# EAGLE schematic ampli-blt-cargador (EAGLE 9.6.2)

## Sheet 1 of 2
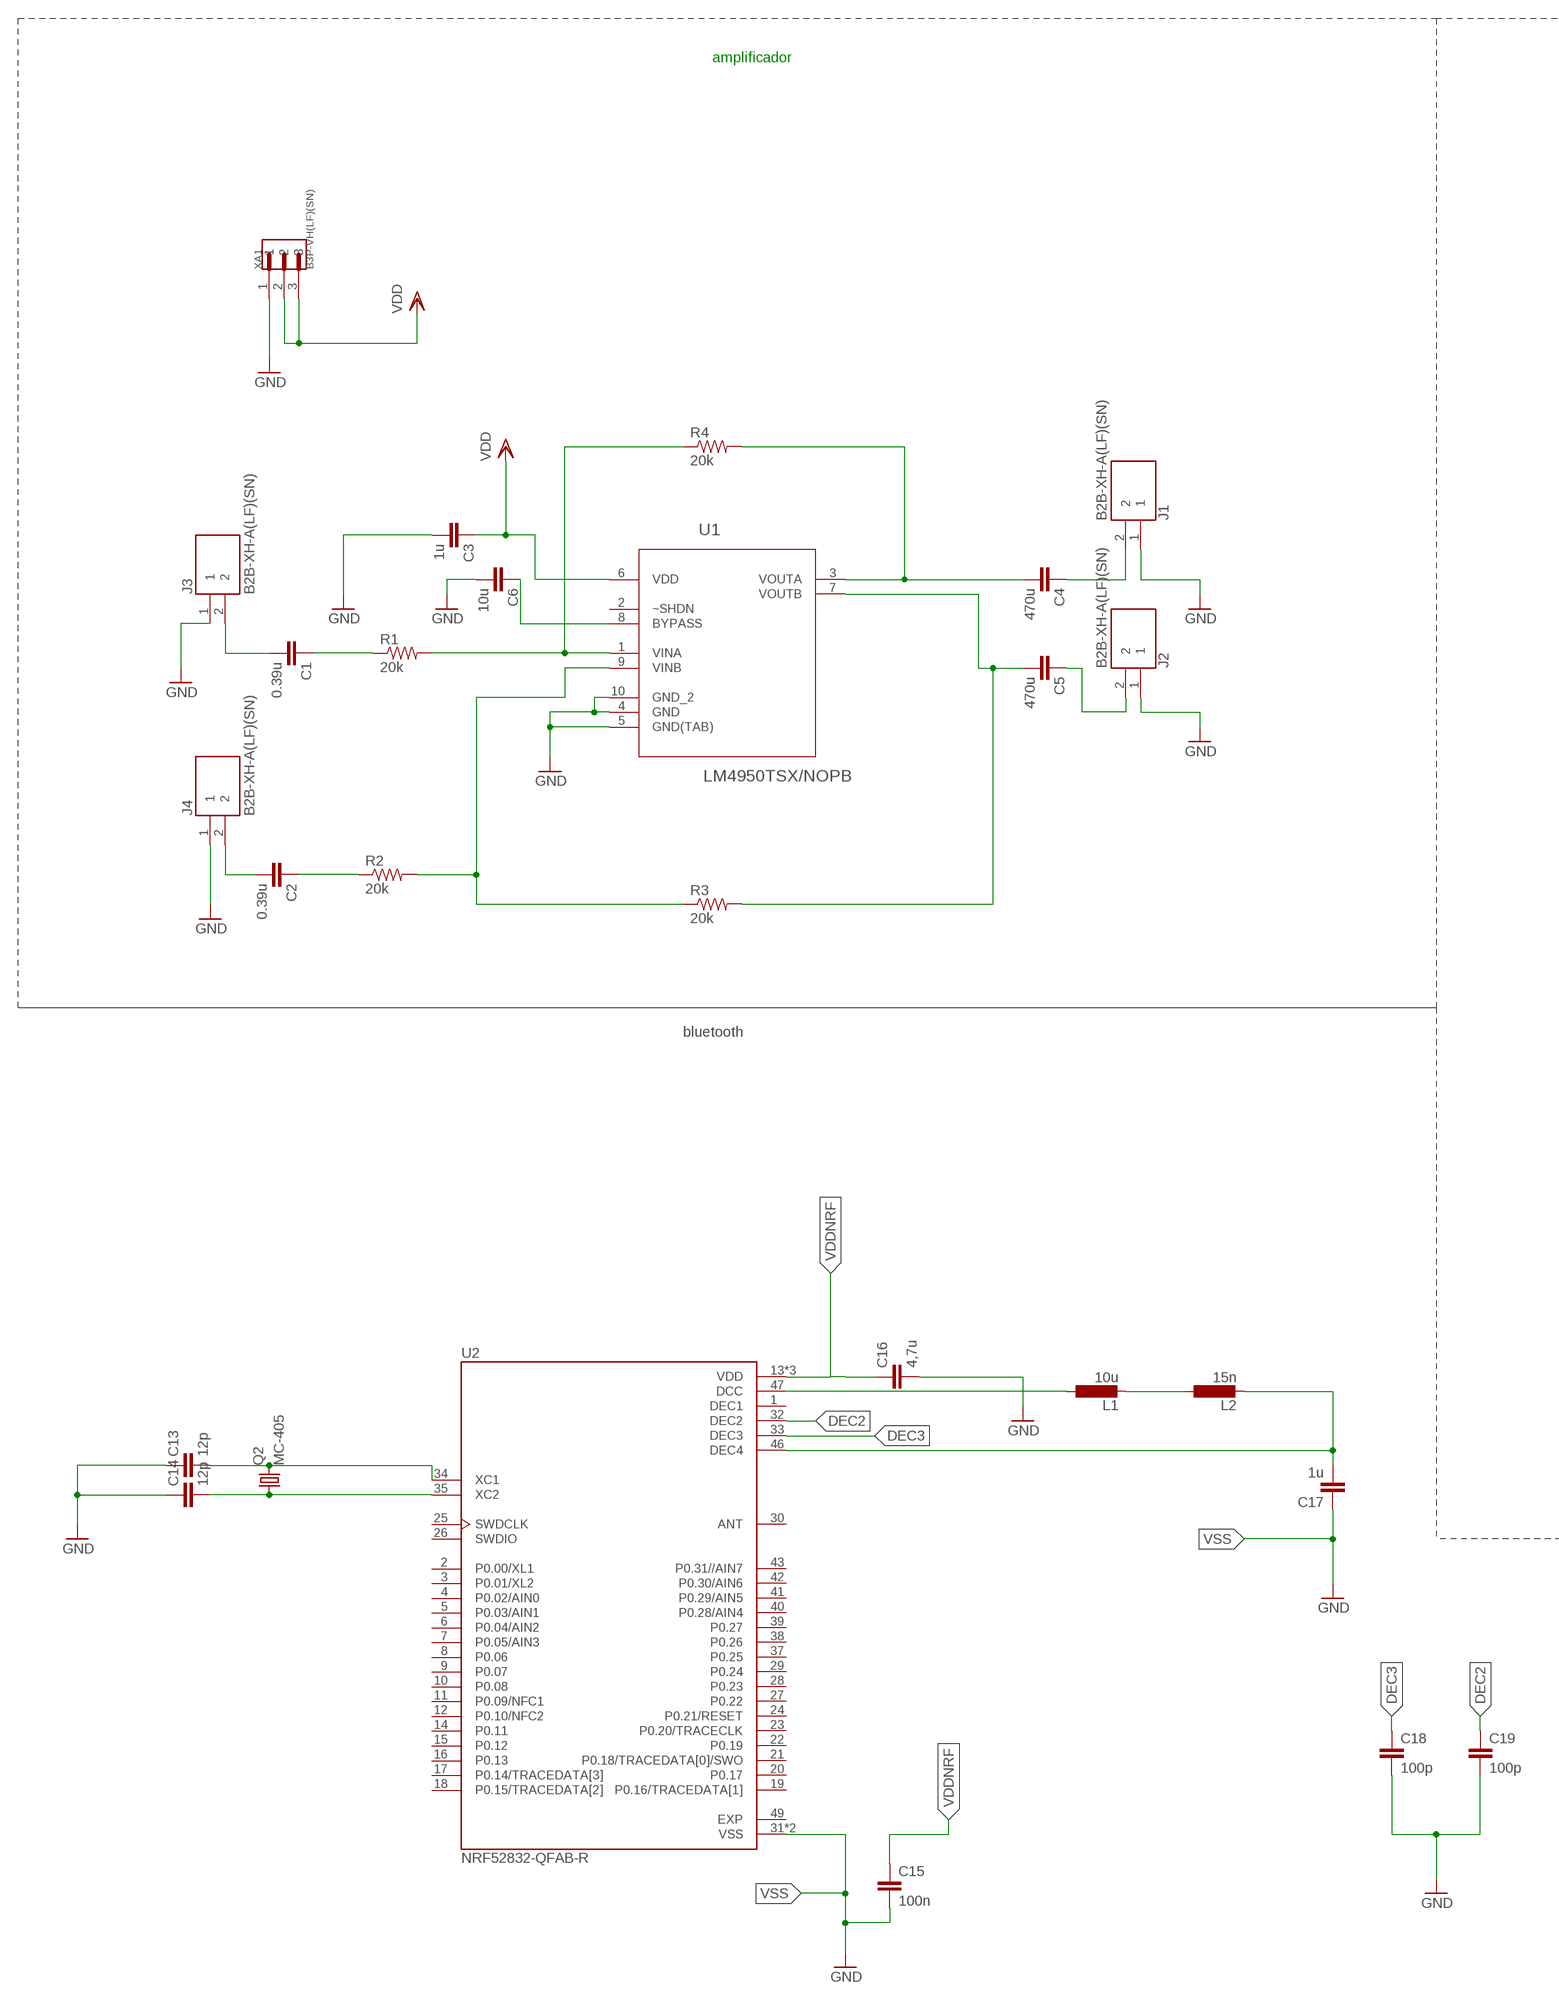
[diagram p0: schematic, sheet 1, part 1 of 2]
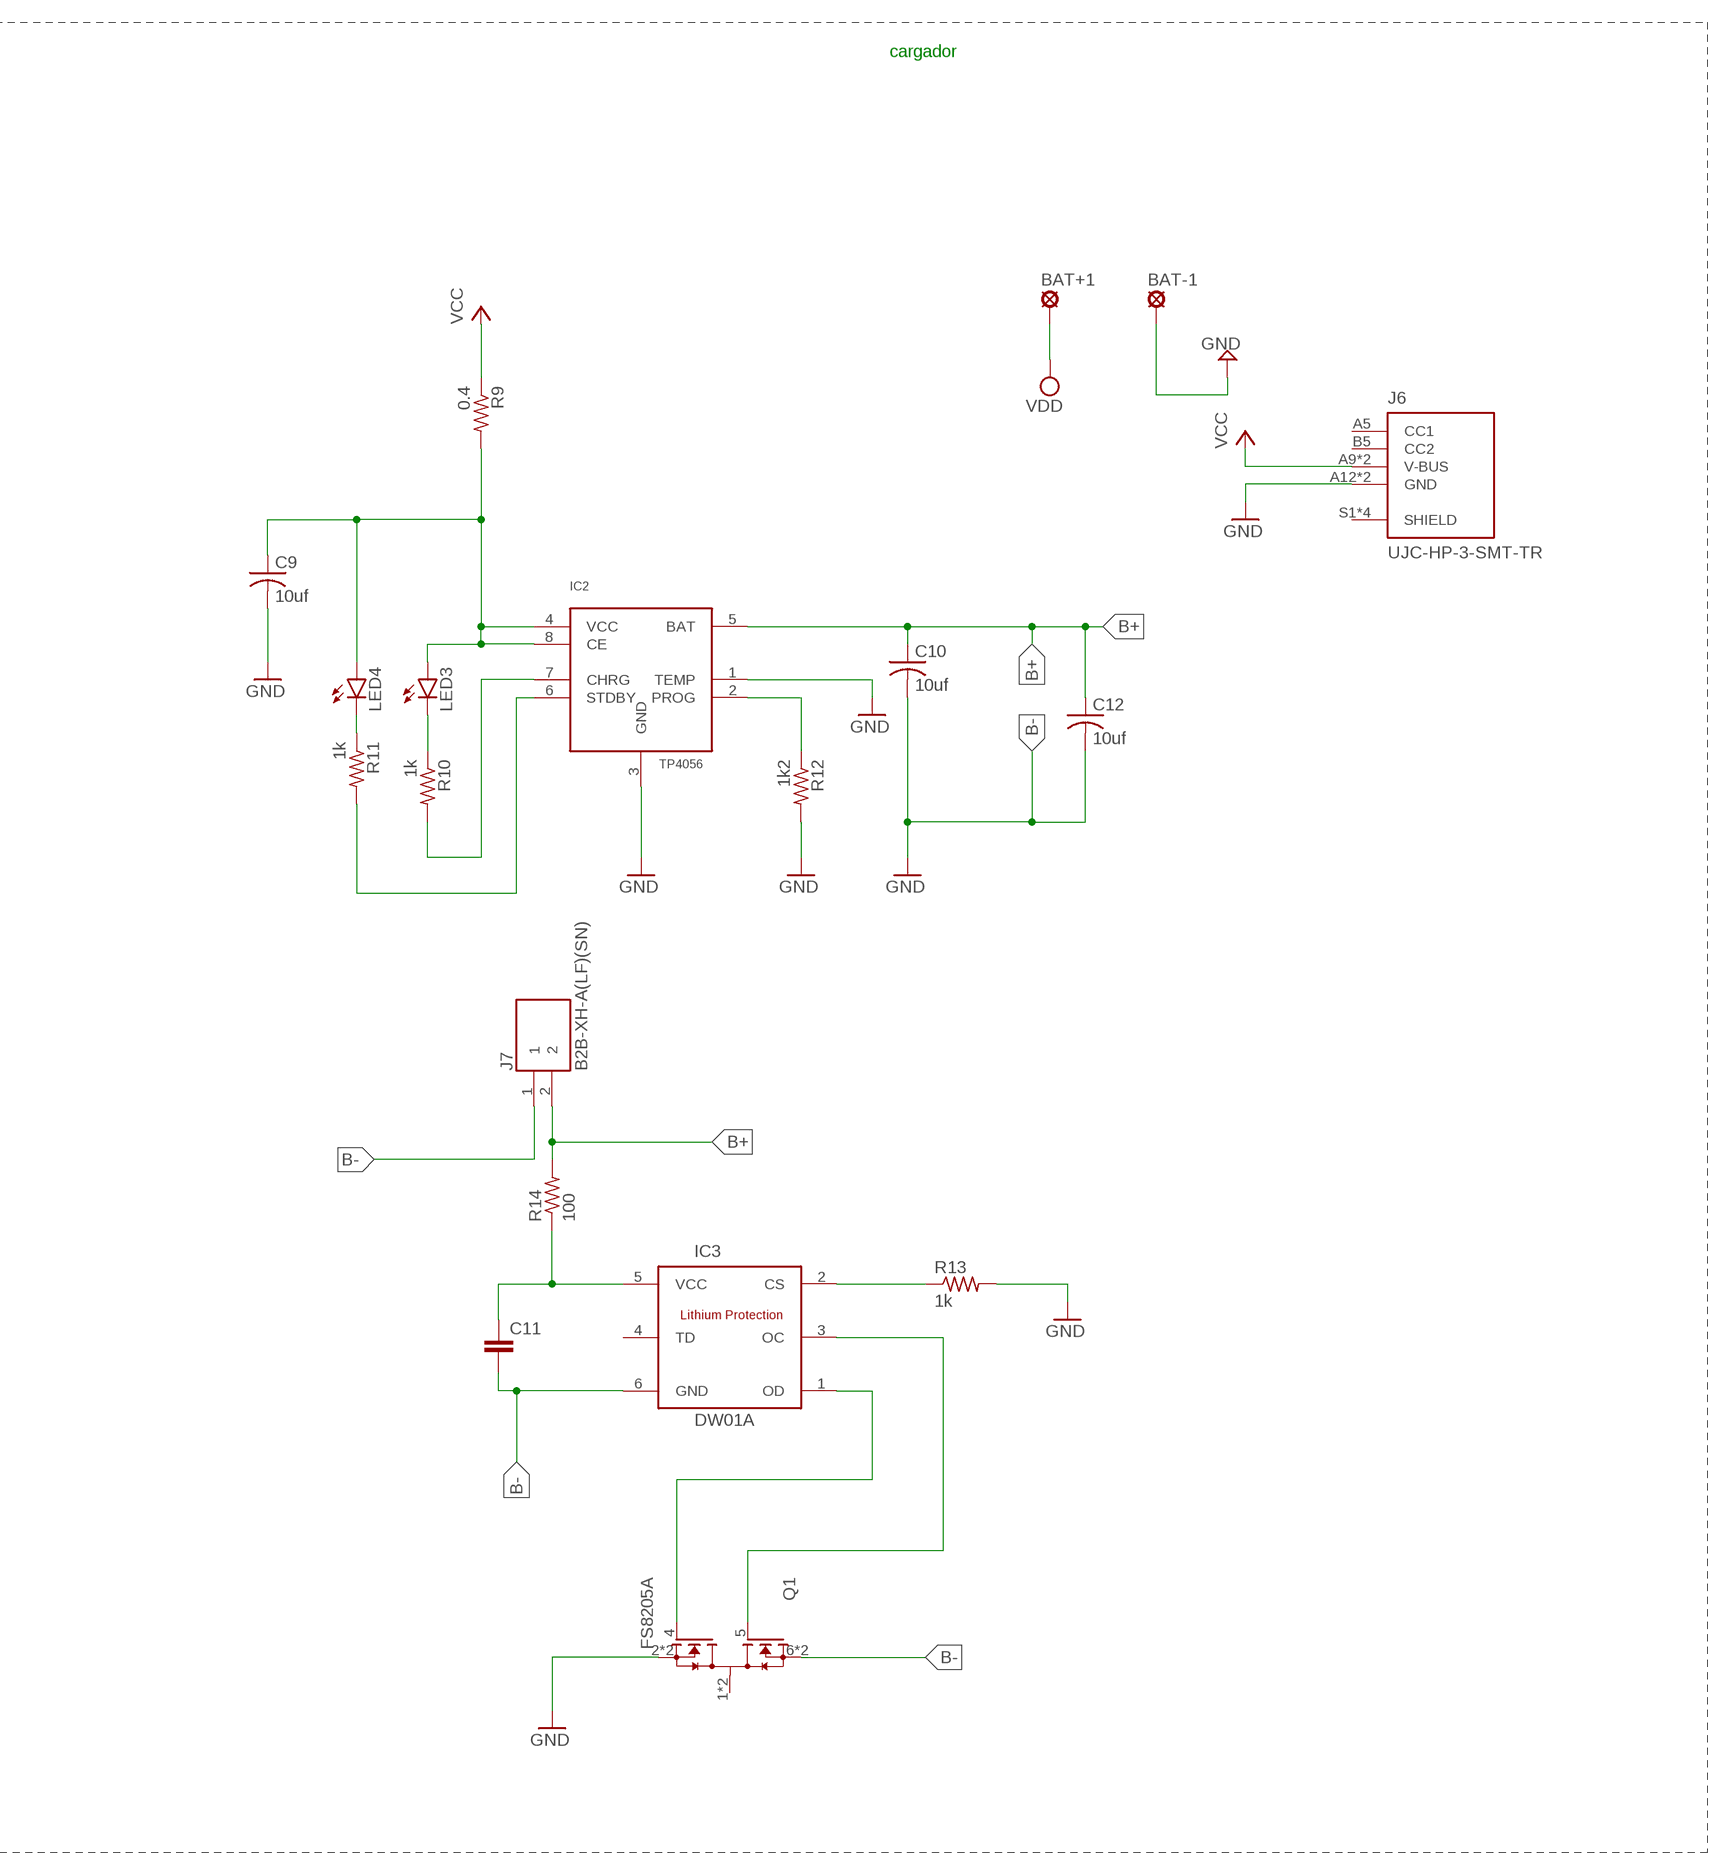
[diagram p1: schematic, sheet 1, part 2 of 2]

### Parts
BAT+1  LSP10  [LSP10]
BAT-1  LSP10  [LSP10]
C1  0.39u  C-EUC1206  [C1206]
C2  0.39u  C-EUC1206  [C1206]
C3  1u  C-EUC1206  [C1206]
C4  470u  C-EUC1206  [C1206]
C5  470u  C-EUC1206  [C1206]
C6  10u  C-EUC1206  [C1206]
C9  10uf  C-USC1206  [C1206]
C10  10uf  C-USC1206  [C1206]
C11  C-EUC1206  [C1206]
C12  10uf  C-USC1206  [C1206]
C13  12p  C-EUC1206  [C1206]
C14  12p  C-EUC1206  [C1206]
C15  100n  C-EUC1206  [C1206]
C16  4,7u  C-EUC1206  [C1206]
C17  1u  C-EUC1206  [C1206]
C18  100p  C-EUC1206  [C1206]
C19  100p  C-EUC1206  [C1206]
IC2  TP4056  [SOP-8]
IC3  DW01A  [SOT23-6]
J1  B2B-XH-A(LF)(SN)  [JST_B2B-XH-A(LF)(SN)]
J2  B2B-XH-A(LF)(SN)  [JST_B2B-XH-A(LF)(SN)]
J3  B2B-XH-A(LF)(SN)  [JST_B2B-XH-A(LF)(SN)]
J4  B2B-XH-A(LF)(SN)  [JST_B2B-XH-A(LF)(SN)]
J6  UJC-HP-3-SMT-TR  [CUI_UJC-HP-3-SMT-TR]
J7  B2B-XH-A(LF)(SN)  [JST_B2B-XH-A(LF)(SN)]
L1  10u  L-EUL2012C  [L2012C]
L2  15n  L-EUL2012C  [L2012C]
LED3  LEDSML1206  [SML1206]
LED4  LEDSML1206  [SML1206]
Q1  FS8205A  [SOP65P640X120-8N]
Q2  MC-405  [MC-405]
R1  20k  R-US_R1206  [R1206]
R2  20k  R-US_R1206  [R1206]
R3  20k  R-US_R1206  [R1206]
R4  20k  R-US_R1206  [R1206]
R9  0.4  R-US_R1206  [R1206]
R10  1k  R-US_R1206  [R1206]
R11  1k  R-US_R1206  [R1206]
R12  1k2  R-US_R1206  [R1206]
R13  1k  R-US_R1206  [R1206]
R14  100  R-US_R1206  [R1206]
U1  LM4950TSX/NOPB  [TO97P1435X457-10N]
U2  NRF52832-QFAB-R  [QFN40P600X600X90-49N]
XA1  B3P-VH(LF)(SN)  [JST_B3P-VH(LF)(SN)]

### Nets
B+: C10.1 C12.1 IC2.5(BAT) J7.2 R14.2
B-: C10.2 C11.2 C12.2 IC3.6(GND) J7.1 Q1.6(S2) Q1.7(S2) ; supply symbol labelled GND
DEC2: C19.1 U2.32(DEC2)
DEC3: C18.1 U2.33(DEC3)
GND: BAT-1.MP C3.2 C6.2 C9.2 C13.1 C14.1 C16.2 C18.2 C19.2 IC2.1(TEMP) IC2.3(GND) J1.1 J2.1 J3.1 J4.1 J6.A12(GND) J6.B12(GND) Q1.2(S1) Q1.3(S1) R12.2 R13.2 U1.4(GND) U1.5(GND(TAB)) U1.10(GND_2) XA1.1 ; also sheet 2
N$1: R2.2 R3.1 U1.9(VINB)
N$2: C2.1 R2.1
N$3: R1.2 R4.1 U1.1(VINA)
N$4: C1.1 R1.1
N$5: C6.1 U1.8(BYPASS)
N$6: C4.1 J1.2
N$7: C4.2 R4.2 U1.3(VOUTA)
N$8: C5.2 R3.2 U1.7(VOUTB)
N$9: C1.2 J3.2
N$10: C5.1 J2.2
N$11: C2.2 J4.2
N$12: IC3.2(CS) R13.1
N$19: C9.1 IC2.4(VCC) IC2.8(CE) LED3.A LED4.A R9.2
N$20: LED3.C R10.1
N$21: IC2.7(CHRG) R10.2
N$22: LED4.C R11.1
N$23: IC2.6(STDBY) R11.2
N$24: IC2.2(PROG) R12.1
N$25: IC3.3(OC) Q1.5(G2)
N$26: IC3.1(OD) Q1.4(G1)
N$27: C11.1 IC3.5(VCC) R14.1
N$28: C13.2 Q2.2 U2.34(XC1)
N$29: C14.2 Q2.1 U2.35(XC2)
N$30: L1.2 L2.1
N$31: L1.1 U2.47(DCC)
N$32: C17.2 L2.2 U2.46(DEC4)
VCC: J6.A9(V-BUS) J6.B9(V-BUS) R9.1 ; also sheet 2
VDD: BAT+1.MP C3.1 U1.6(VDD) XA1.2 XA1.3 ; also sheet 2
VDDNRF: C15.1 C16.1 U2.13(VDD) U2.36(VDD) U2.48(VDD)
VSS: C15.2 C17.1 U2.31(VSS) U2.45(VSS) ; supply symbol labelled GND
Unconnected: IC3.4(TD) J6.A5(CC1) J6.B5(CC2) J6.S1(SHIELD) J6.S2(SHIELD) J6.S3(SHIELD) J6.S4(SHIELD) Q1.1(D12) Q1.8(D12) U1.2(~SHDN) U2.2(P0.00/XL1) U2.3(P0.01/XL2) U2.4(P0.02/AIN0) U2.5(P0.03/AIN1) U2.6(P0.04/AIN2) U2.7(P0.05/AIN3) U2.8(P0.06) U2.9(P0.07) U2.10(P0.08) U2.11(P0.09/NFC1) U2.12(P0.10/NFC2) U2.14(P0.11) U2.15(P0.12) U2.16(P0.13) U2.17(P0.14/TRACEDATA[3]) U2.18(P0.15/TRACEDATA[2]) U2.19(P0.16/TRACEDATA[1]) U2.20(P0.17) U2.21(P0.18/TRACEDATA[0]/SWO) U2.22(P0.19) U2.23(P0.20/TRACECLK) U2.24(P0.21/RESET) U2.25(SWDCLK) U2.26(SWDIO) U2.27(P0.22) U2.28(P0.23) U2.29(P0.24) U2.30(ANT) U2.37(P0.25) U2.38(P0.26) U2.39(P0.27) U2.40(P0.28/AIN4) U2.41(P0.29/AIN5) U2.42(P0.30/AIN6) U2.43(P0.31//AIN7)

### Notes on the sheet
- cargador
- amplificador
- bluetooth

## Sheet 2 of 2
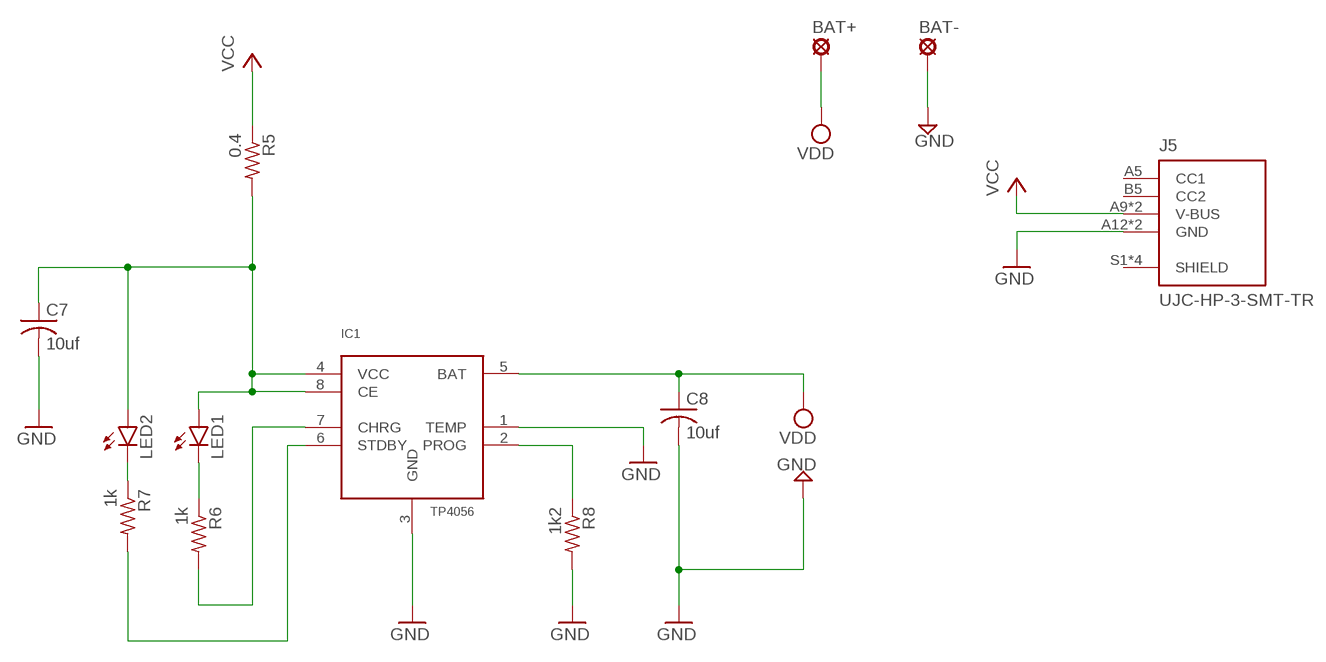
[diagram p2: schematic, sheet 2]

### Parts
BAT+  LSP10  [LSP10]
BAT-  LSP10  [LSP10]
C7  10uf  C-USC1206  [C1206]
C8  10uf  C-USC1206  [C1206]
IC1  TP4056  [SOP-8]
J5  UJC-HP-3-SMT-TR  [CUI_UJC-HP-3-SMT-TR]
LED1  LEDSML1206  [SML1206]
LED2  LEDSML1206  [SML1206]
R5  0.4  R-US_R1206  [R1206]
R6  1k  R-US_R1206  [R1206]
R7  1k  R-US_R1206  [R1206]
R8  1k2  R-US_R1206  [R1206]

### Nets
GND: BAT-.MP C7.2 C8.2 IC1.1(TEMP) IC1.3(GND) J5.A12(GND) J5.B12(GND) R8.2 ; also sheet 1
N$13: C7.1 IC1.4(VCC) IC1.8(CE) LED1.A LED2.A R5.2
N$14: LED1.C R6.1
N$15: IC1.7(CHRG) R6.2
N$16: LED2.C R7.1
N$17: IC1.6(STDBY) R7.2
N$18: IC1.2(PROG) R8.1
VCC: J5.A9(V-BUS) J5.B9(V-BUS) R5.1 ; also sheet 1
VDD: BAT+.MP C8.1 IC1.5(BAT) ; also sheet 1
Unconnected: J5.A5(CC1) J5.B5(CC2) J5.S1(SHIELD) J5.S2(SHIELD) J5.S3(SHIELD) J5.S4(SHIELD)

## Power pins joined to a net without a drawn wire
DEC1: U2.1(DEC1)
EXP: U2.49(EXP)

## Library data of the parts
BAT+ BAT+1 BAT- BAT-1 = solpad:LSP10: SOLDER PAD drill 1.0 mm, distributor Buerklin, 12H555
C1-C6 C11 C13-C19 = rcl:C-EU: CAPACITOR, European symbol; SPICEPREFIX: C
C7-C10 C12 = rcl:C-US: CAPACITOR, American symbol; SPICEPREFIX: C
IC1 IC2 = TP4056:TP4056; AVAILABILITY: Unavailable; DESCRIPTION: Complete single cell Li-Ion battery with a constant current / constant voltage linear charger; MF: NanJing Top Power ASIC Corp.; MP: TP4056; PACKAGE: Package; PRICE: None
IC3 = DW01A:DW01A; AVAILABILITY: Unavailable; DESCRIPTION: One Cell Lithium-ion/Polymer Battery Protection IC; MF: Fortune Semiconductor; MP: DW01A; PACKAGE: SOT-23-6 Fortune Semiconductor; PRICE: None
J1-J4 J7 = B2B-XH-A_LF__SN_:B2B-XH-A(LF)(SN): XH Series 2 Position 2.5 mm Pitch Through Hole Top Entry Shrouded Header Check prices <https://pricing.snapeda.com/parts/B2B-XH-A%28LF%29%28SN%29/JST%20Sales/view-part?ref=eda>; AVAILABILITY: Good; DESCRIPTION: Connector Header Through Hole 2 position 0.098 (2.50mm); MF: JST Sales; MP: B2B-XH-A(LF)(SN); PACKAGE: None; PRICE: None
J5 J6 = UJC-HP-3-SMT-TR:UJC-HP-3-SMT-TR: USB RECEPTACLE Check prices <https://pricing.snapeda.com/parts/UJC-HP-3-SMT-TR/CUI%20Devices/view-part?ref=eda>; AVAILABILITY: Good; CUI_PURCHASE_URL: https://www.cuidevices.com/product/interconnect/connectors/usb-connectors/ujc-hp-3-smt-tr?utm_source=snapeda.com&utm_medium=referral&utm_campaign=snapedaBOM; DESCRIPTION: Type C, 3 A, Right Angle, Surface Mount (SMT), Power-Only USB Receptacle; MF: CUI Devices; MP: UJC-HP-3-SMT-TR; PACKAGE: Package; PRICE: None; PURCHASE-URL: https://pricing.snapeda.com/search/part/UJC-HP-3-SMT-TR/?ref=eda
L1 L2 = rcl:L-EU: INDUCTOR, European symbol; SPICEPREFIX: L
LED1-LED4 = led:LED: LED OSRAM: - CHIPLED LG R971, LG N971, LY N971, LG Q971, LY Q971, LO R971, LY R971 LH N974, LH R974 LS Q976, LO Q976, LY Q976 LO Q996 - Hyper CHIPLED LW Q18S LB Q993, LB Q99A, LB R99A - SideLED LS A670, LO A670, LY A670, LG A670, LP A670 LB A673, LV A673, LT A673, LW A673 LH A674 LY A675 LS A676, LA A676, LO A676, LY A676, LW A676 LS A679, LY A679, LG A679 - Hyper Micro SIDELED® LS Y876, LA Y876, LO Y876, LY Y876 LT Y87S - SmartLED LW L88C, LW L88S LB L89C, LB L89S, LG L890 LS L89K, LO L89K, LY L89K LS L896, LA L896, LO L896, LY L896 - TOPLED LS T670, LO T670, LY T670, LG T670, LP T670 LSG T670, LSP T670, LSY T670, LOP T670, LYG T670 LG T671, LOG T671, LSG T671 LB T673, LV T673, LT T673, LW T673 LH T674 LS T676, LA T676, LO T676, LY T676, LB T676, LH T676, LSB T676, LW T676 LB T67C, LV T67C, LT T67C, LS T67K, LO T67K, LY T67K, LW E67C LS E67B, LA E67B, LO E67B, LY E67B, LB E67C, LV E67C, LT E67C LW T67C LS T679, LY T679, LG T679 LS T770, LO T770, LY T770, LG T770, LP T770 LB T773, LV T773, LT T773, LW T773 LH T774 LS E675, LA E675, LY E675, LS T675 LS T776, LA T776, LO T776, LY T776, LB T776 LHGB T686 LT T68C, LB T68C - Hyper Mini TOPLED® LB M676 - Mini TOPLED Santana® LG M470 LS M47K, LO M47K, LY M47K Source: http://www.osram.convergy.de LUXEON: - LUMILED® LXK2-PW12-R00, LXK2-PW12-S00, LXK2-PW14-U00, LXK2-PW14-V00 LXK2-PM12-R00, LXK2-PM12-S00, LXK2-PM14-U00 LXK2-PE12-Q00, LXK2-PE12-R00, LXK2-PE12-S00, LXK2-PE14-T00, LXK2-PE14-U00 LXK2-PB12-K00, LXK2-PB12-L00, LXK2-PB12-M00, LXK2-PB14-N00, LXK2-PB14-P00, LXK2-PB14-Q00 LXK2-PR12-L00, LXK2-PR12-M00, LXK2-PR14-Q00, LXK2-PR14-R00 LXK2-PD12-Q00, LXK2-PD12-R00, LXK2-PD12-S00 LXK2-PH12-R00, LXK2-PH12-S00 LXK2-PL12-P00, LXK2-PL12-Q00, LXK2-PL12-R00 Source: www.luxeon.com KINGBRIGHT: KA-3528ASYC Source: www.kingbright.com
Q1 = FS8205A:FS8205A: N/A; AVAILABILITY: Unavailable; MF: Fortune Semiconductor; MP: FS8205A; PACKAGE: Package; PRICE: None
Q2 = crystal:MC-405: kHz RANGE CRYSTAL UNIT SMD Source: MC-306_405_406_E07X.PDF Homepage <http://www.epsontoyocom.co.jp>; OC_FARNELL: unknown; OC_NEWARK: unknown
R1-R14 = rcl:R-US_: RESISTOR, American symbol; SPICEPREFIX: R
U1 = LM4950TSX_NOPB:LM4950TSX/NOPB: 3.1W Stereo Audio Power Amplifier Check prices <https://pricing.snapeda.com/parts/LM4950TSX/NOPB/Texas%20Instruments/view-part?ref=eda>; AVAILABILITY: Good; DESCRIPTION: 7.5W Mono-BTL or 3.1W Stereo Audio Power Amplifier 9-DDPAK/TO-263 -40 to 85; MF: Texas Instruments; MP: LM4950TSX/NOPB; PACKAGE: TO-263-9 Texas Instruments; PRICE: None; PURCHASE-URL: https://pricing.snapeda.com/search/part/LM4950TSX/NOPB/?ref=eda
U2 = NRF52832-QFAB-R:NRF52832-QFAB-R: nRF52832 multiprotocol 2, 4G SoC Check prices <https://pricing.snapeda.com/parts/NRF52832-QFAB-R/Nordic%20Semiconductor/view-part?ref=eda>; AVAILABILITY: Good; DESCRIPTION: IC RF TxRx + MCU Bluetooth, General ISM > 1GHz ANT, Bluetooth v5.0 2.4GHz 48-VFQFN Exposed Pad; MF: Nordic Semiconductor; MP: NRF52832-QFAB-R; PACKAGE: VFQFN-48 Nordic Semiconductor; PRICE: None; PURCHASE-URL: https://pricing.snapeda.com/search/part/NRF52832-QFAB-R/?ref=eda
XA1 = B3P-VH_LF__SN_:B3P-VH(LF)(SN): VH Series 3 Position 3.96 mm Pitch Through Hole Crimp Locking Header Check prices <https://pricing.snapeda.com/parts/B3P-VH%28LF%29%28SN%29/JST%20Sales/view-part?ref=eda>; AVAILABILITY: Warning; DESCRIPTION: Connector Header Through Hole 3 position 0.156 (3.96mm); MF: JST Sales; MP: B3P-VH(LF)(SN); PACKAGE: Custom Package JST; PRICE: None; PURCHASE-URL: https://pricing.snapeda.com/search/part/B3P-VH(LF)(SN)/?ref=eda